# EAGLE design pmod_vga6 (EAGLE 7.2.0)
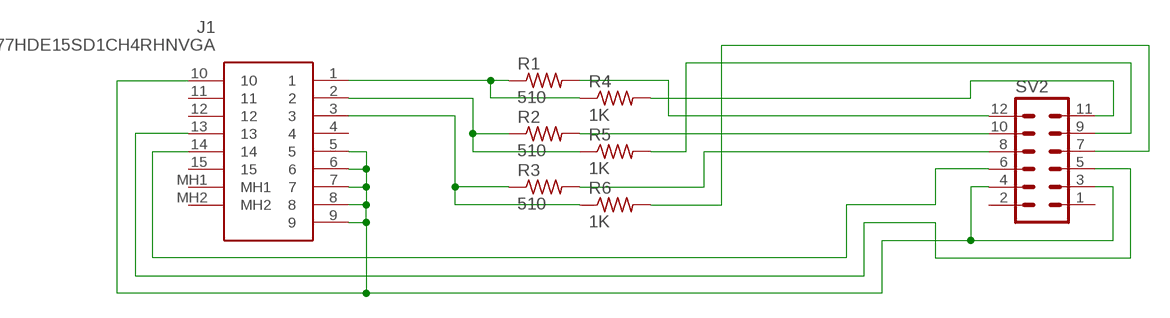
[diagram p0: schematic, sheet 1]

## Parts
J1  L77HDE15SD1CH4RHNVGA  [L77HDE15SD1CH4RHNVGA]
R1  510  R-US_R0805  [R0805]
R2  510  R-US_R0805  [R0805]
R3  510  R-US_R0805  [R0805]
R4  1K  R-US_R0805  [R0805]
R5  1K  R-US_R0805  [R0805]
R6  1K  R-US_R0805  [R0805]
SV2  MA06-2  [MA06-2]

## Nets
N$1: J1.1 R1.1 R4.1
N$2: J1.2 R2.1 R5.1
N$3: J1.3 R3.1 R6.1
N$4: R1.2 SV2.12
N$5: R4.2 SV2.11
N$6: R2.2 SV2.10
N$7: R5.2 SV2.9
N$8: R3.2 SV2.8
N$9: R6.2 SV2.7
N$12: J1.14 SV2.6
N$13: J1.13 SV2.5
N$14: J1.5 J1.6 J1.7 J1.8 J1.9 J1.10 SV2.3 SV2.4
Unconnected: J1.4 J1.11 J1.12 J1.15 J1.MH1 J1.MH2 SV2.1 SV2.2

## Library data of the parts
J1 = dsub15_2.00_L77HDE15SD1CH4RHNVGA:L77HDE15SD1CH4RHNVGA: D-Sub High Density Connectors Dsub, Stamped Signal 3A, High Density, Right Angle PCB Thru Hole, FP=8.89mm (.350"), 15 Socket, Bright Tin Shell, Flash Gold, 4-40 Rear Insert, Ground Tab with Boardlock, High Temp, Nickel Shell, VGA Source: Datasheet <https://componentsearchengine.com/Datasheets/1/L77HDE15SD1CH4RHNVGA.pdf>; DESCRIPTION: D-Sub High Density Connectors Dsub, Stamped Signal 3A, High Density, Right Angle PCB Thru Hole, FP=8.89mm (.350"), 15 Socket, Bright Tin Shell, Flash Gold, 4-40 Rear Insert, Ground Tab with Boardlock, High Temp, Nickel Shell, VGA; HEIGHT: 12.55mm; MANUFACTURER_NAME: Amphenol; MANUFACTURER_PART_NUMBER: L77HDE15SD1CH4RHNVGA; MOUSER_PART_NUMBER: 523-7HDE15SDH4RHNVGA; MOUSER_PRICE-STOCK: https://www.mouser.co.uk/ProductDetail/Amphenol-Commercial-Products/L77HDE15SD1CH4RHNVGA?qs=f9yNj16SXrKPVxRw%2FcVQYg%3D%3D
R1-R6 = adafruit:R-US_: RESISTOR, American symbol
SV2 = con-lstb:MA06-2: PIN HEADER; OC_FARNELL: unknown; OC_NEWARK: unknown

## Net classes
0 default: width 0.4 mm, drill 0.6 mm, clearance 0.2 mm

## Board
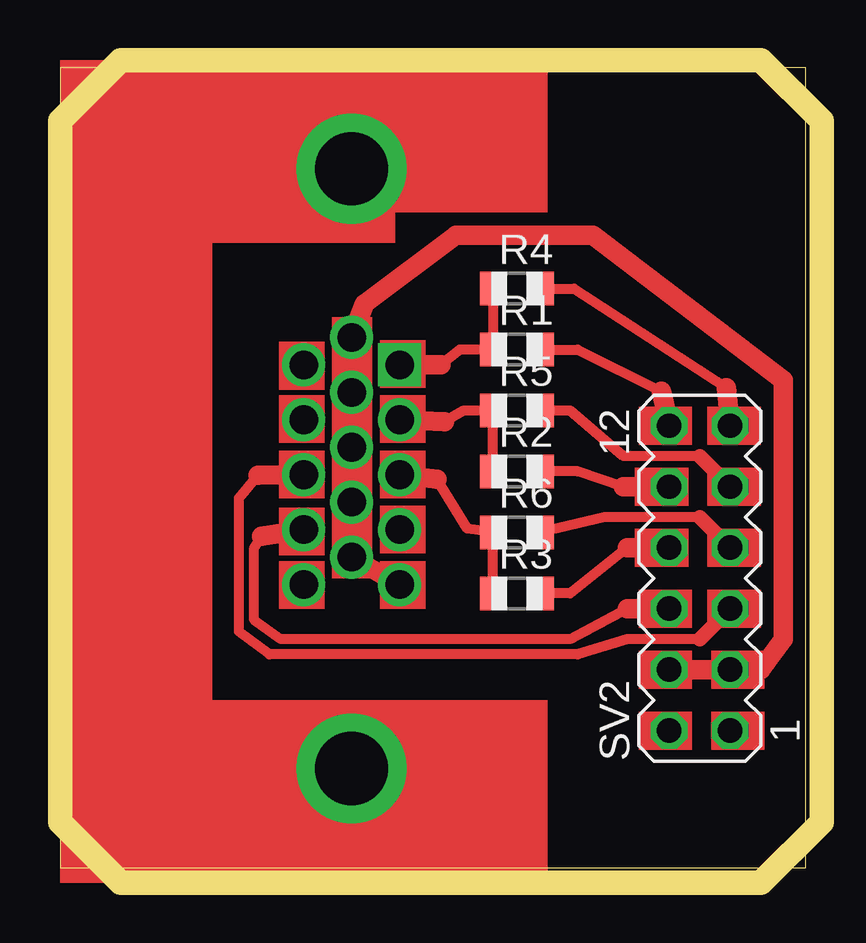
[diagram p1: board, top side]
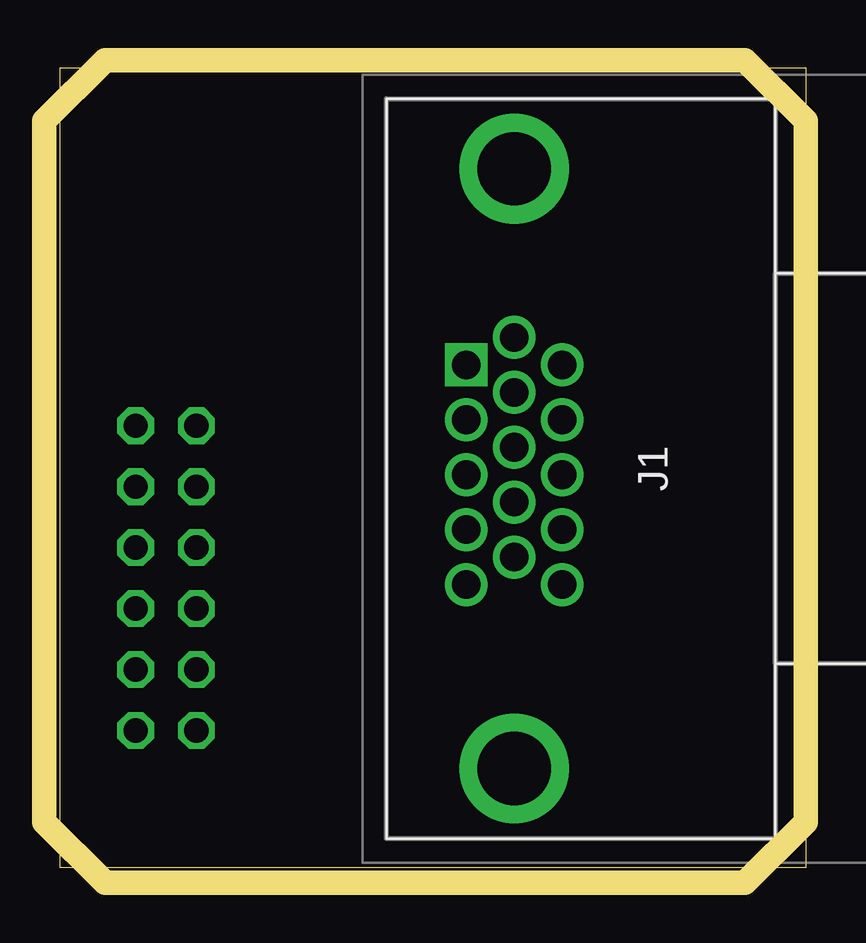
[diagram p2: board, bottom side, seen from below]

Size 31.09 x 33.33 mm. Coordinates in mm from the lower left corner, seen from the top.
Outline: 0,0 31.09,0 31.09,33.33 0,33.33 0,0
Copper layers (1*16): Top 0.035mm / dielectric 1.5mm / Bottom 0.035mm
Design rules "default": minimum track width 10mil, minimum drill 24mil, track to track 8mil, track to pad 8mil, pad to pad 8mil, via to via 8mil, smd to smd 8mil, copper to edge 40mil, drill to drill 8mil, minimum pad ring 10mil, minimum via ring 8mil, stop-mask expansion 4mil, vias tented up to drill 0mil, thermal gap 10mil
Milling: 8 lines

### Footprints (pad centres in the part's own frame; a part is rotated, then mirrored left to right if it is on the bottom)
L77HDE15SD1CH4RHNVGA = drill 1.19 pad 1.785 square: 1 0,4 | drill 1.19 pad 1.785: 2 -2.29,4; 3 -4.58,4; 4 -6.87,4; 5 -9.16,4; 6 1.145,2; 7 -1.145,2; 8 -3.435,2; 9 -5.725,2; 10 -8.015,2; 11 0,0; 12 -2.29,0; 13 -4.58,0; 14 -6.87,0; 15 -9.16,0 | drill 3.05 pad 4.575: MH1 8.17,2; MH2 -16.82,2
R0805 = smd 1.1 x 1.4: 1 -1,0; 2 1,0
MA06-2 = drill 1.016 octagon: 1 -6.35,-1.27; 2 -6.35,1.27; 3 -3.81,-1.27; 4 -3.81,1.27; 5 -1.27,-1.27; 6 -1.27,1.27; 7 1.27,-1.27; 8 1.27,1.27; 9 3.81,-1.27; 10 3.81,1.27; 11 6.35,-1.27; 12 6.35,1.27

### Placement (x,y rotation side)
J1  10.16,20.95 90 bottom
R1  19.05,21.59 0 top
R2  19.05,16.51 0 top
R3  19.05,11.43 0 top
R4  19.05,24.13 0 top
R5  19.05,19.05 0 top
R6  19.05,13.97 0 top
SV2  26.67,12.06 90 top

### Tracks (layer width: path | path; a pad name or v marks a point on that pad's centre or on a via)
N$1
  Top 0.406: R4.1 R1.1 16.67,21.59 15.88,20.95
  Top 0.813: 15.88,20.95 J1.1
N$2
  Top 0.406: R2.1 R5.1 16.83,19.05 16.03,18.57
  Top 0.813: 16.03,18.57 J1.2
N$3
  Top 0.406: R3.1 R6.1 16.99,14.13 15.72,16.19
  Top 0.813: 15.72,16.19 J1.3
N$4
  Top 0.406: R1.2 21.59,21.59 25.08,19.84
  Top 0.813: 25.08,19.84 SV2.12
N$5
  Top 0.406: R4.2 21.43,24.13 27.78,20
  Top 0.813: 27.78,20 SV2.11
N$6
  Top 0.406: 23.5,15.88 21.59,16.51 R2.2
  Top 0.813: SV2.10 23.5,15.88
N$7
  Top 0.406: 26.67,17.14 23.5,17.14 21.27,19.05 R5.2
  Top 0.61: SV2.9 26.67,17.14
N$8
  Top 0.406: 23.65,13.34 21.27,11.43 R3.2
  Top 0.813: SV2.8 23.65,13.34
N$9
  Top 0.406: 26.67,14.61 22.7,14.61 R6.2
  Top 0.61: SV2.7 26.67,14.61
N$12
  Top 0.406: 23.65,10.79 21.27,9.53 9.21,9.53 8.1,10.32 8.1,13.34 8.41,13.81
  Top 0.813: SV2.6 23.65,10.79 | 8.41,13.81 J1.14
N$13
  Top 0.406: 26.67,9.53 23.65,9.53 21.59,8.89 8.73,8.89 7.46,9.84 7.46,15.4 8.26,16.35
  Top 0.61: SV2.5 26.67,9.53
  Top 0.813: 8.26,16.35 J1.13
N$14
  Top 0.813: J1.5 J1.10 J1.9 J1.8 J1.7 J1.6 12.7,23.49 16.51,26.35 22.23,26.35 30.16,20.32 30.16,9.53 29.21,8.26 SV2.3 SV2.4
(copper drawn outside any net)
  shapes: Top area x27